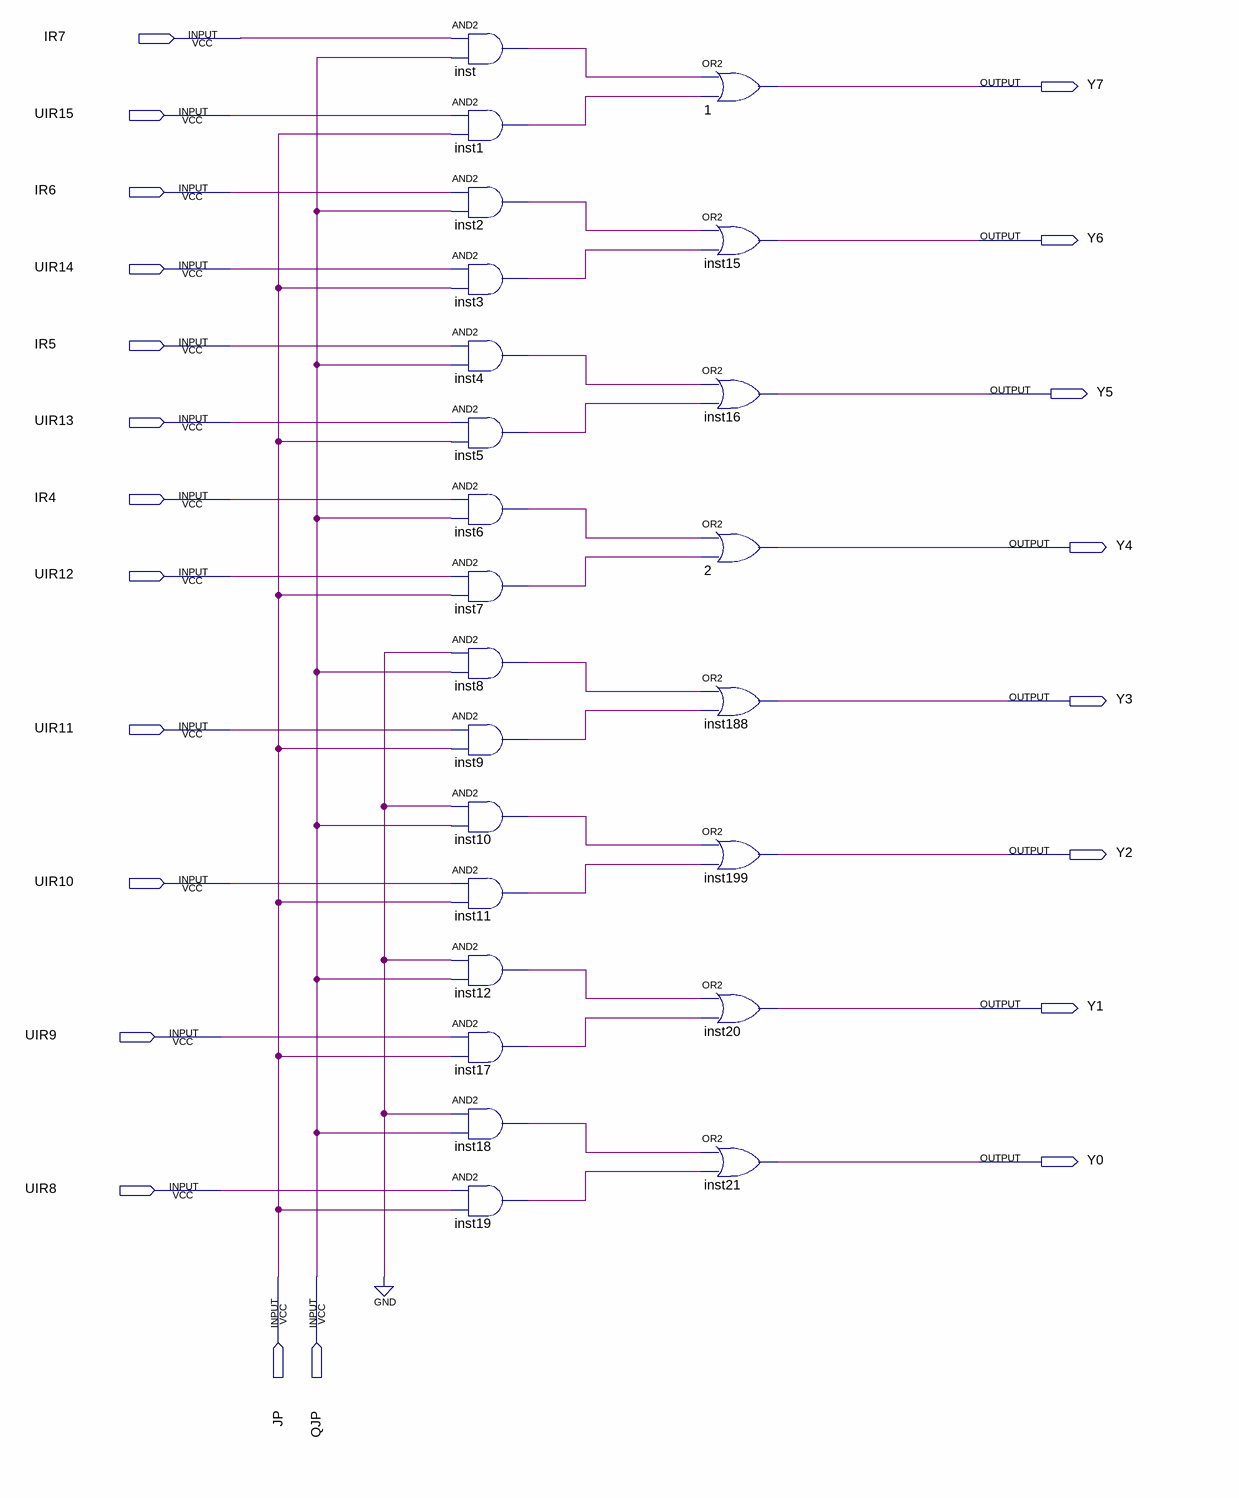
[diagram p0: schematic sheet]
// Quartus schematic formadd.bdf as structural Verilog: 24 symbols, 22 pins
module formadd (
  input  IR7,
  input  UIR15,
  input  IR6,
  input  UIR14,
  input  IR5,
  input  UIR13,
  input  IR4,
  input  UIR12,
  input  UIR11,
  input  UIR10,
  input  UIR9,
  input  UIR8,
  input  JP,
  input  QJP,
  output Y7,
  output Y6,
  output Y5,
  output Y4,
  output Y3,
  output Y2,
  output Y1,
  output Y0
);

  wire inst1_out, inst2_out, inst3_out, inst4_out, inst5_out, inst6_out, inst7_out, inst8_out, inst9_out,
       inst10_out, inst11_out, inst12_out, inst17_out, inst18_out, inst19_out, inst_out;

  and inst (inst_out, IR7, QJP);
  and inst1 (inst1_out, UIR15, JP);
  and inst2 (inst2_out, IR6, QJP);
  and inst3 (inst3_out, UIR14, JP);
  and inst4 (inst4_out, IR5, QJP);
  and inst5 (inst5_out, UIR13, JP);
  and inst6 (inst6_out, IR4, QJP);
  and inst7 (inst7_out, UIR12, JP);
  and inst8 (inst8_out, 1'b0, QJP);
  and inst9 (inst9_out, UIR11, JP);
  and inst10 (inst10_out, 1'b0, QJP);
  and inst11 (inst11_out, UIR10, JP);
  and inst12 (inst12_out, 1'b0, QJP);
  and inst17 (inst17_out, UIR9, JP);
  and inst18 (inst18_out, 1'b0, QJP);
  and inst19 (inst19_out, UIR8, JP);
  or u_1 (Y7, inst_out, inst1_out);
  or inst15 (Y6, inst2_out, inst3_out);
  or inst16 (Y5, inst4_out, inst5_out);
  or u_2 (Y4, inst6_out, inst7_out);
  or inst188 (Y3, inst8_out, inst9_out);
  or inst199 (Y2, inst10_out, inst11_out);
  or inst20 (Y1, inst12_out, inst17_out);
  or inst21 (Y0, inst18_out, inst19_out);
endmodule
